# Altium project 线圈.PrjPCB
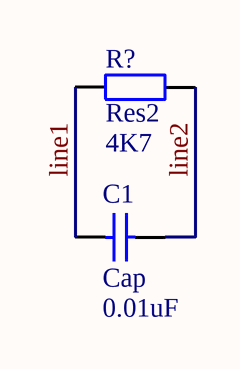
[diagram p0: INDUCTOR.SchDoc]
1 sheet, 2 parts. Net scope: global (net labels, ports and power ports of the same name join across sheets).
Board files: 线圈2.PcbDoc, 线圈3.PcbDoc, 线圈5.PcbDoc

## Sheet INDUCTOR.SchDoc
size A3

### Parts
C1  Cap  value 0.01uF  [C2012]
R?  Res2  value 4K7  [0603]

### Nets
line1: C1.1 R?.1
line2: C1.2 R?.2

### Library data of the parts
C1 = Cap: Capacitor; Published: 8-Jun-2000; LatestRevisionDate: 17-Jul-2002; LatestRevisionNote: Re-released for DXP Platform.; PackageReference: RAD-0.3; Publisher: Altium Limited; PackageDescription: Radial Cap, Thru-Hole; 2 Leads; 0.3 in Pin Spacing
R? = Res2: Resistor; Published: 8-Jun-2000; LatestRevisionDate: 17-Jul-2002; LatestRevisionNote: Re-released for DXP Platform.; PackageReference: AXIAL-0.4; Publisher: Altium Limited; PackageDescription: Axial Device, Thru-Hole; 2 Leads; 0.4 in Pin Spacing